# Altium project UHAL_MPL115A1.PrjPcb
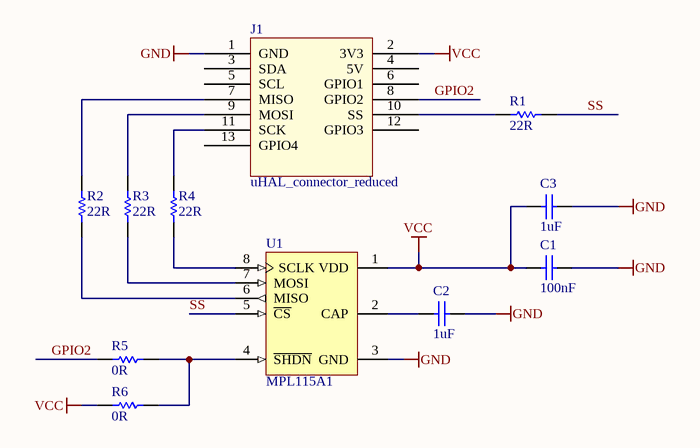
[diagram p0: mpl115a1.SchDoc]
1 sheet, 11 parts. Net scope: global (net labels, ports and power ports of the same name join across sheets).

## Sheet mpl115a1.SchDoc
size A4

### Parts
C1  Capacitance: 100nF  [CAPC1608X90X35ML10T15]  (hidden comment: Murata GCM188R71H104KA57D)
C2  Capacitance: 1uF  [CAPC1608X90X35ML10T15]  (hidden comment: Murata GCM188R71H104KA57D)
C3  Capacitance: 1uF  [CAPC1608X90X35ML10T15]  (hidden comment: Murata GCM188R71H104KA57D)
J1  uHAL_connector_reduced  [PCB-45ncoppm4oopozvqifsq-1]
R1  22R  [RESC1608X05N]
R2  22R  [RESC1608X05N]
R3  22R  [RESC1608X05N]
R4  22R  [RESC1608X05N]
R5  0R  [RESC1608X05N]
R6  0R  [RESC1608X05N]
U1  MPL115A1  [FRES-2015-02-A-8_V]

### Nets
GND: C1.1 C2.1 C3.1 J1.1(GND) U1.3(GND)
VCC: C1.2 C3.2 J1.2(3V3) R6.1 U1.1(VDD)
GPIO2: J1.8(GPIO2) R5.2
SS: R1.2 U1.5(~{CS})
NetC2_2: C2.2 U1.2(CAP)
NetJ1_7: J1.7(MISO) R2.1
NetJ1_9: J1.9(MOSI) R3.1
NetJ1_10: J1.10(SS) R1.1
NetJ1_11: J1.11(SCK) R4.1
NetR2_2: R2.2 U1.6(MISO)
NetR3_2: R3.2 U1.7(MOSI)
NetR4_2: R4.2 U1.8(SCLK)
NetR5_1: R5.1 R6.2 U1.4(~{SHDN})

Not connected (* = marked no-connect by the designer): J1 3(SDA) 4(5V) 5(SCL) 6(GPIO1) 12(GPIO3) 13(GPIO4)

### Library data of the parts
C1-C3 = CMP-119667-3: CAP CER 0.1UF 50V 10% X7R 0603; Lead-Free Status: Lead Free; Voltage Rating (DC): 50.0 V; Capacitance Tolerance: ±10%; Dielectric Characteristic: X7R; Octopart Url: https://octopart.com/gcm188r71h104ka57d-murata-7894792; OctopartID: 3480fdf266eeeb47; Packaging: Cut Tape (CT); REACH SVHC Compliance: No SVHC; RoHS: Compliant
J1 = CMP-2q23h2cwhjlfm8s6r7i8-1: connector for uHAL with reduced pin number; CustomComponentID: 2q23h2cwhjlfm8s6r7i8
R1-R6 = CMP-31acf99032f6ee6b-1: RCA Series 0603 0.1 W 0 O Jumper Surface Mount Thick Film Chip Resistor; Manufacturer Part Number: RCA06030000ZSEA; Lead-Free Status: Lead Free; Power Rating: 100 mW; Case/Package (SI): 1608; RoHS: Compliant; Case/Package: 0603, 1608; OctopartID: 31acf99032f6ee6b; Packaging: Cut Tape (CT); Octopart URL: https://octopart.com/rca06030000zsea-vishay-20325948
U1 = CMP-2436ede32d3ffbf1-1: Pressure Sensor 0V to 0.4V/0V to 0.6V 50kPa to 115kPa Absolute 8-Pin LGA Tray; Supply Voltage (DC): V; Supply Current: 3.5e-06 A; Manufacturer Part Number: MPL115A1; Number of Pins: 8; REACH SVHC Compliance: No SVHC; RoHS: Compliant; OctopartID: 2436ede32d3ffbf1; Octopart URL: http://octopart.com/mpl115a1-freescale+semiconductor-14625903; Mounting Style: Surface Mount; Lifecycle Status: Active; Halogen Free Status: Halogen Free